# EAGLE schematic V1_LM339 (EAGLE 6.5.0)
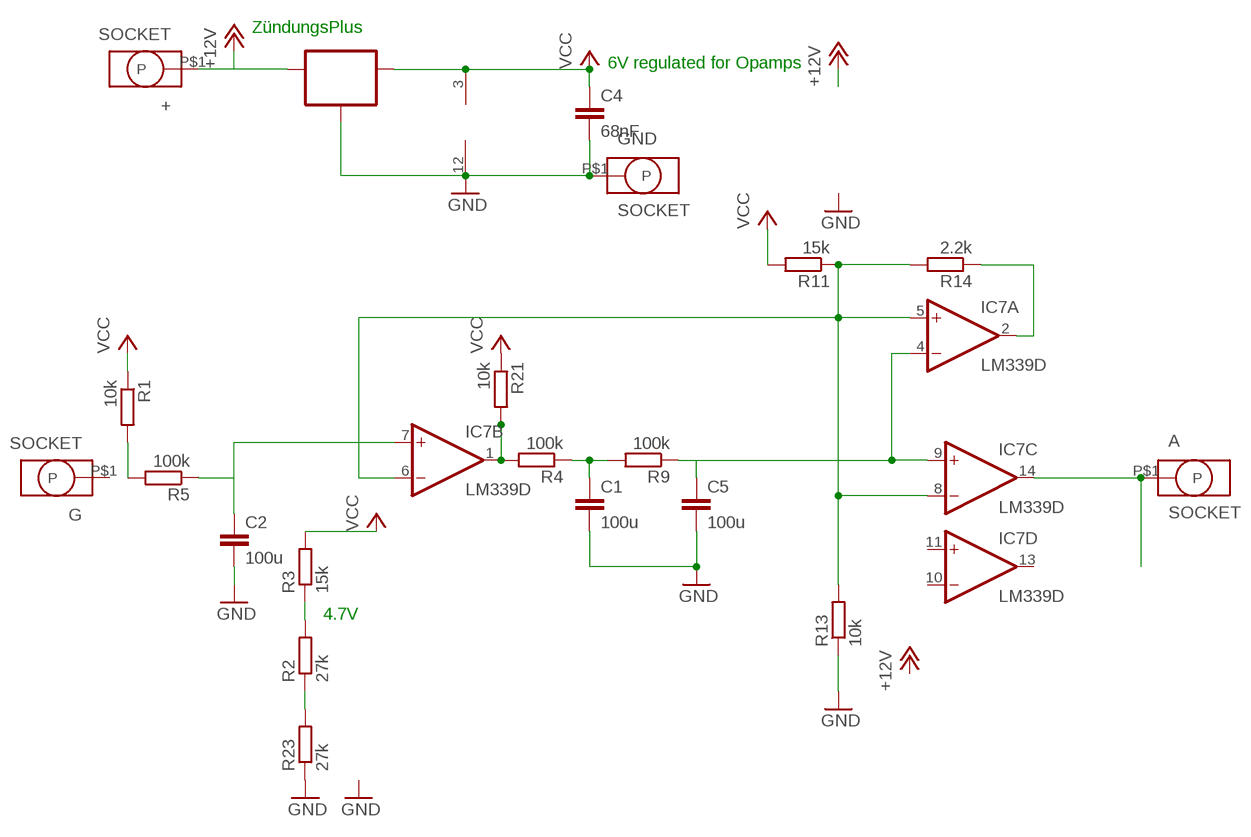
[diagram p0: schematic, sheet 1]

## Parts
+  SOCKET  [ID2.5MM]
A  SOCKET  [ID2.5MM]
C1  100u  C-EUC1206K  [C1206K]
C2  100u  C-EUC1206K  [C1206K]
C4  68nF  C-EUC1206K  [C1206K]
C5  100u  C-EUC1206K  [C1206K]
G  SOCKET  [ID2.5MM]
GND  SOCKET  [ID2.5MM]
IC2  78LXXSOT89_ROUND  [SOT89_ROUND]
IC7  LM339D  [SO14]
R1  10k  R-EU_R0805  [R0805]
R2  27k  R-EU_R0805  [R0805]
R3  15k  R-EU_R0805  [R0805]
R4  100k  R-EU_R0805  [R0805]
R5  100k  R-EU_R0805  [R0805]
R9  100k  R-EU_R0805  [R0805]
R11  15k  R-EU_R0805  [R0805]
R13  10k  R-EU_R0805  [R0805]
R14  2.2k  R-EU_R0805  [R0805]
R21  10k  R-EU_R0805  [R0805]
R23  27k  R-EU_R0805  [R0805]

## Nets
+12V: +.P$1(P) IC2.3(IN)
GND: C1.2 C2.2 C4.2 C5.2 GND.P$1(P) IC2.2(GND) IC2.2@1(GND) IC7.12(P:GND) R13.1 R23.1
N$1: C2.1 IC7.7(B:+IN) R5.1
N$2: R2.2 R3.1
N$3: C1.1 R4.1 R9.2
N$4: C5.1 IC7.4(A:-IN) IC7.9(C:+IN) R9.1
N$5: IC7.5(A:+IN) IC7.6(B:-IN) IC7.8(C:-IN) R11.1 R13.2 R14.2
N$6: R1.2 R5.2
N$7: R2.1 R23.2
N$8: A.P$1(P) IC7.14(C:OUT)
N$10: IC7.2(A:OUT) R14.1
N$580: IC7.1(B:OUT) R4.2 R21.2
VCC: C4.1 IC2.1(OUT) IC7.3(P:V+) R1.1 R3.2 R11.2 R21.1
Unconnected: G.P$1(P) IC7.10(D:-IN) IC7.11(D:+IN) IC7.13(D:OUT)

## Notes on the sheet
- ZündungsPlus
- 6V regulated for Opamps
- 4.7V

## Library data of the parts
+ A G GND = Brotbox_Socket_Header:SOCKET
C1 C2 C4 C5 = rcl:C-EU: CAPACITOR, European symbol
IC2 = 78LXX:78LXX
IC7 = linear:LM339: Low Power Low Offset Voltage Quad Comparators with open collector; LM139/LM239/LM339/LM2901/LM3302
R1-R5 R9 R11 R13 R14 R21 R23 = rcl:R-EU_: RESISTOR, European symbol